# Altium schematic sheet main.SchDoc
size A4
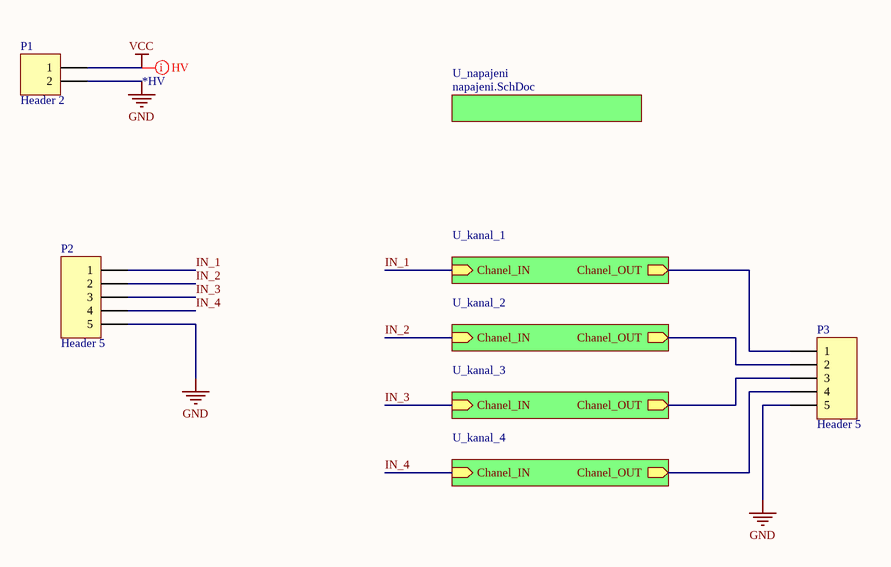
[diagram p0: main.SchDoc]

## Parts
P1  Header 2  [HDR1X2]
P2  Header 5  [HDR1X5]
P3  Header 5  [HDR1X5]

## Sub-sheets
U_kanal_1 = kanal.SchDoc: Chanel_IN (in), Chanel_OUT (out)
U_kanal_2 = kanal.SchDoc: Chanel_IN (in), Chanel_OUT (out)
U_kanal_3 = kanal.SchDoc: Chanel_IN (in), Chanel_OUT (out)
U_kanal_4 = kanal.SchDoc: Chanel_IN (in), Chanel_OUT (out)
U_napajeni = napajeni.SchDoc: no entries

## Nets
GND: P1.2 P2.5 P3.5
VCC: P1.1
IN_1: P2.1 ; sheet U_kanal_1/Chanel_IN
IN_2: P2.2 ; sheet U_kanal_2/Chanel_IN
IN_3: P2.3 ; sheet U_kanal_3/Chanel_IN
IN_4: P2.4 ; sheet U_kanal_4/Chanel_IN
NetP3_1: P3.1 ; sheet U_kanal_1/Chanel_OUT
NetP3_2: P3.2 ; sheet U_kanal_2/Chanel_OUT
NetP3_3: P3.3 ; sheet U_kanal_3/Chanel_OUT
NetP3_4: P3.4 ; sheet U_kanal_4/Chanel_OUT

## Layout directives
net class *HV: VCC

## Library data of the parts
P1 = Header 2: Header, 2-Pin; LatestRevisionDate: 17-Jul-2002; LatestRevisionNote: Re-released for DXP Platform.; Publisher: Altium Limited
P2 P3 = Header 5: Header, 5-Pin; LatestRevisionDate: 17-Jul-2002; LatestRevisionNote: Re-released for DXP Platform.; Publisher: Altium Limited